# Altium schematic sheet SolderingStation_Processor.SchDoc
size A4
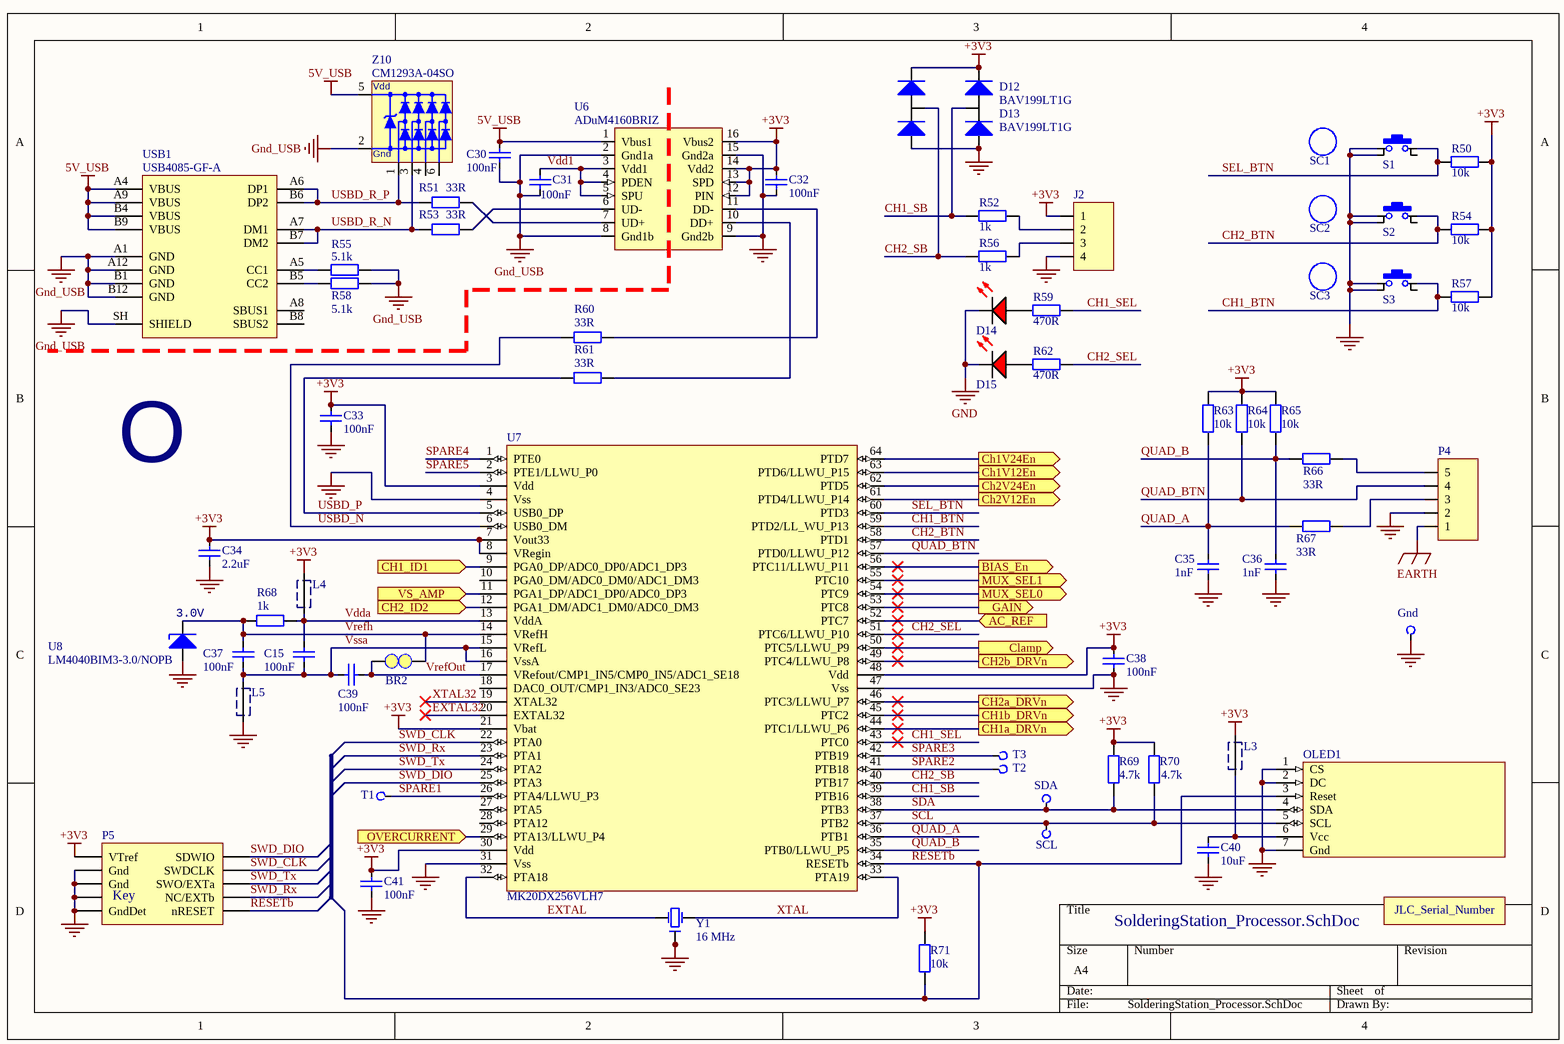
[diagram p0: SolderingStation_Processor.SchDoc]

## Parts
BR2  Solder Bridge (Open)  [SolderBridge(Open)]  (value not drawn)  (no BOM)
C15  100nF  [CCNP1608-0603_N]
C30  100nF  [CCNP1608-0603_N]
C31  100nF  [CCNP1608-0603_N]
C32  100nF  [CCNP1608-0603_N]
C33  100nF  [CCNP1608-0603_N]
C34  2.2uF  [CCNP1608-0603_N]
C35  1nF  [CCNP1608-0603_N]
C36  1nF  [CCNP1608-0603_N]
C37  100nF  [CCNP1608-0603_N]
C38  100nF  [CCNP1608-0603_N]
C39  100nF  [CCNP1608-0603_N]
C40  10uF  [CCNP2012-0805]
C41  100nF  [CCNP1608-0603_N]
D12  BAV199LT1G  [SOT23_M]
D13  BAV199LT1G  [SOT23_M]
D14  LED  [LED3MM-RED - 10mm Proud]  (value not drawn)
D15  LED  [LED3MM-RED - 10mm Proud]  (value not drawn)
Gnd  Gnd  [PCBPIN - 0.9mm]  (value not drawn)  (no BOM)
J2  JST XH Connector, 4-Pin  [jst-b4b-xh-ax]  (value not drawn)
JLC_Serial_Number1  JLC_Serial_Number  [JLC_Serial_Number]  (value not drawn)  (no BOM)
L3  Ferrite Bead 600R@100MHz  [FB2012-0805]  (value not drawn)
L4  Ferrite Bead 600R@100MHz  [FB1608-0603]  (value not drawn)
L5  Ferrite Bead 600R@100MHz  [FB1608-0603]  (value not drawn)
Logo1  OSHW Logo  [OSHW]  (value not drawn)  (no BOM)
OLED1  OLED_Display  [OLED_Display_128x64_2.4inch - no mounting holes]  (value not drawn)
P4  Header, 5-Pin  [HDR1X5S]  (value not drawn)
P5  SWD Connector 2x5-Pin  [SWD-2x5-Jig-Header]  (value not drawn)  (no BOM)
R50  10k  [CR1608-0603_N]
R51  33R  [CR1608-0603_N]
R52  1k  [CR1608-0603_N]
R53  33R  [CR1608-0603_N]
R54  10k  [CR1608-0603_N]
R55  5.1k  [CR1608-0603_N]
R56  1k  [CR1608-0603_N]
R57  10k  [CR1608-0603_N]
R58  5.1k  [CR1608-0603_N]
R59  470R  [CR1608-0603_N]
R60  33R  [CR1608-0603_N]
R61  33R  [CR1608-0603_N]
R62  470R  [CR1608-0603_N]
R63  10k  [CR1608-0603_N]
R64  10k  [CR1608-0603_N]
R65  10k  [CR1608-0603_N]
R66  33R  [CR1608-0603_N]
R67  33R  [CR1608-0603_N]
R68  1k  [CR1608-0603_N]
R69  4.7k  [CR1608-0603_N]
R70  4.7k  [CR1608-0603_N]
R71  10k  [CR1608-0603_N]
S1  SW_PB-B3F1052  [SW_MIN_PB-B3F1052]  (value not drawn)
S2  SW_PB-B3F1052  [SW_MIN_PB-B3F1052]  (value not drawn)
S3  SW_PB-B3F1052  [SW_MIN_PB-B3F1052]  (value not drawn)
SC1  B32-2010  [SW-CAP-B32-2010]  (value not drawn)
SC2  B32-2010  [SW-CAP-B32-2010]  (value not drawn)
SC3  B32-2010  [SW-CAP-B32-2010]  (value not drawn)
SCL  SCL  [PCBPIN - 0.9mm]  (value not drawn)  (no BOM)
SDA  SDA  [PCBPIN - 0.9mm]  (value not drawn)  (no BOM)
T1  PTA4  [PCBPIN - 0.9mm]  (value not drawn)  (no BOM)
T2  PTB18  [PCBPIN - 0.9mm]  (value not drawn)  (no BOM)
T3  PTB19  [PCBPIN - 0.9mm]  (value not drawn)  (no BOM)
U6  ADuM4160BRIZ  [SOIC127P1030-16M]
U7  MK20DX256VLH7  [TSQFP50P1200X1200-64M]
U8  LM4040BIM3-3.0/NOPB  [SOT23_M]
USB1  USB4085-GF-A  [USB4085-GF-A]
Y1  16 MHz  [Crystal_SMD_3.2x2.5]
Z10  CM1293A-04SO  [SOT457_M - 180]

## Ports
AC_REF (in), BIAS_En (out), CH1_ID1 (in), CH1a_DRVn (out), CH1b_DRVn (out), Ch1V12En (out), Ch1V24En (out), CH2_ID2 (in), CH2a_DRVn (out), CH2b_DRVn (out), Ch2V12En (out), Ch2V24En (out), Clamp (out), GAIN (out), MUX_SEL0 (out), MUX_SEL1 (out), OVERCURRENT (in), VS_AMP (in)

## Nets
5V_USB: C30.2 U6.1(Vbus1) USB1.A4(VBUS) USB1.A9(VBUS) USB1.B4(VBUS) USB1.B9(VBUS) Z10.5(Vp)
+3V3: C32.2 C33.2 C34.2 C38.2 C41.2 D12.2(A2) D13.2(A2) J2.1 L3.1 L4.2 P5.1(VTref) R50.2 R54.2 R57.2 R63.2 R64.2 R65.2 R69.2 R70.2 R71.2 U6.12(PIN) U6.13(SPD) U6.14(Vdd2) U6.16(Vbus2) U7.3(Vdd) U7.7(Vout33) U7.8(VRegin) U7.21(Vbat) U7.30(Vdd) U7.48(Vdd)
EARTH: P4.1
GND: C32.1 C33.1 C34.1 C35.1 C36.1 C38.1 C40.1 C41.1 D12.1(A1) D13.1(A1) D14.K D15.K Gnd.1(TP) J2.4 L5.1 OLED1.1(CS) OLED1.2(DC) OLED1.7(Gnd) P4.2 P5.0(Pins) P5.3(Gnd) P5.5(Gnd) P5.9(GndDet) S1.1 S1.1b S2.1 S2.1b S3.1 S3.1b U6.9(Gnd2b) U6.15(Gnd2a) U7.4(Vss) U7.31(Vss) U7.47(Vss) U8.2(A) Y1.2(Gnd) Y1.4(Gnd)
Gnd_USB: C30.1 C31.1 R55.2 R58.2 U6.2(Gnd1a) U6.8(Gnd1b) USB1.A1(GND) USB1.A12(GND) USB1.B1(GND) USB1.B12(GND) USB1.SH(SHIELD) Z10.2(Vn)
AC_REF: U7.52(PTC7) ; port AC_REF
BIAS_En: U7.56(PTC11/LLWU_P11) ; port BIAS_En
CH1_BTN: R57.1 S3.2 U7.59(PTD2/LL_WU_P13)
CH1_ID1: U7.9(PGA0_DP/ADC0_DP0/ADC1_DP3) ; port CH1_ID1
CH1_SB: D13.3(K) R52.1 U7.39(PTB16)
CH1_SEL: R59.1 U7.43(PTC0)
CH1a_DRVn: U7.44(PTC1/LLWU_P6) ; port CH1a_DRVn
CH1b_DRVn: U7.45(PTC2) ; port CH1b_DRVn
Ch1V12En: U7.63(PTD6/LLWU_P15) ; port Ch1V12En
Ch1V24En: U7.64(PTD7) ; port Ch1V24En
CH2_BTN: R54.1 S2.2 U7.58(PTD1)
CH2_ID2: U7.12(PGA1_DM/ADC1_DM0/ADC0_DM3) ; port CH2_ID2
CH2_SB: D12.3(K) R56.1 U7.40(PTB17)
CH2_SEL: R62.2 U7.51(PTC6/LLWU_P10)
CH2a_DRVn: U7.46(PTC3/LLWU_P7) ; port CH2a_DRVn
CH2b_DRVn: U7.49(PTC4/LLWU_P8) ; port CH2b_DRVn
Ch2V12En: U7.61(PTD4/LLWU_P14) ; port Ch2V12En
Ch2V24En: U7.62(PTD5) ; port Ch2V24En
Clamp: U7.50(PTC5/LLWU_P9) ; port Clamp
EXTAL: U7.32(PTA18) Y1.3(OSC2)
EXTAL32: U7.20(EXTAL32)
GAIN: U7.53(PTC8) ; port GAIN
MUX_SEL0: U7.54(PTC9) ; port MUX_SEL0
MUX_SEL1: U7.55(PTC10) ; port MUX_SEL1
OVERCURRENT: U7.29(PTA13/LLWU_P4) ; port OVERCURRENT
QUAD_A: C35.2 R63.1 R67.2 U7.36(PTB1)
QUAD_B: C36.2 R65.1 R66.2 U7.35(PTB0/LLWU_P5)
QUAD_BTN: P4.4 R64.1 U7.57(PTD0/LLWU_P12)
RESETb: OLED1.3(Reset) P5.10(nRESET) R71.1 U7.34(RESETb)
SCL: OLED1.5(SCL) R70.1 SCL.1(TP) U7.37(PTB2)
SDA: OLED1.4(SDA) R69.1 SDA.1(TP) U7.38(PTB3)
SEL_BTN: R50.1 S1.2 U7.60(PTD3)
SPARE1: T1.1(TP) U7.26(PTA4/LLWU_P3)
SPARE2: T2.1(TP) U7.41(PTB18)
SPARE3: T3.1(TP) U7.42(PTB19)
SPARE4: U7.1(PTE0)
SPARE5: U7.2(PTE1/LLWU_P0)
SWD_CLK: P5.4(SWDCLK) U7.22(PTA0)
SWD_DIO: P5.2(SDWIO) U7.25(PTA3)
SWD_Rx: P5.8(NC/EXTb) U7.23(PTA1)
SWD_Tx: P5.6(SWO/EXTa) U7.24(PTA2)
USBD_N: R60.2 U7.6(USB0_DM)
USBD_P: R61.2 U7.5(USB0_DP)
USBD_R_N: R53.2 USB1.A7(DM1) USB1.B7(DM2) Z10.3
USBD_R_P: R51.2 USB1.A6(DP1) USB1.B6(DP2) Z10.1
Vdd1: C31.2 U6.3(Vdd1) U6.4(PDEN) U6.5(SPU)
Vdda: C15.2 L4.1 R68.1 U7.13(VddA)
Vrefh: BR2.2 C37.2 R68.2 U7.14(VRefH) U8.1(K)
VrefOut: BR2.1 C39.2 U7.17(VRefout/CMP1_IN5/CMP0_IN5/ADC1_SE18)
VS_AMP: U7.11(PGA1_DP/ADC1_DP0/ADC0_DP3) ; port VS_AMP
Vssa: C15.1 C37.1 C39.1 L5.2 U7.15(VRefL) U7.16(VssA)
XTAL: U7.33(PTA19) Y1.1(OSC1)
XTAL32: U7.19(XTAL32)
NetC40_2: C40.2 L3.2 OLED1.6(Vcc)
NetD14_A: D14.A R59.2
NetD15_A: D15.A R62.1
NetJ2_2: J2.2 R52.2
NetJ2_3: J2.3 R56.2
NetP4_3: P4.3 R67.1
NetP4_5: P4.5 R66.1
NetR51_1: R51.1 U6.7(UD+)
NetR53_1: R53.1 U6.6(UD-)
NetR55_1: R55.1 USB1.A5(CC1)
NetR58_1: R58.1 USB1.B5(CC2)
NetR60_1: R60.1 U6.11(DD-)
NetR61_1: R61.1 U6.10(DD+)

Not connected (* = marked no-connect by the designer): S1 2b; S2 2b; S3 2b; U7 10(PGA0_DM/ADC0_DM0/ADC1_DM3) 18(DAC0_OUT/CMP1_IN3/ADC0_SE23) 27(PTA5) 28(PTA12); U8 3(NC); USB1 A8(SBUS1) B8(SBUS2); Z10 4 6

## Notes on the sheet
- (near U8) 3.0V
- (in symbol CM1293A-04SO) Vdd; Gnd
- (in symbol OSHW Logo) O
- (in symbol SWD2X5_JIG) Key

## Library data of the parts
BR2 = SolderBridge(Open): Solder bridge; Digikey: *; Farnell PN: *; LCSC: *
C15 C30-C33 C37-C39 C41 = Cap_CCNP_0603_100nF: Capacitor non-polar SMT 0603; Manufacturer: Generic Components; Class: Passive; Published: 08/06/2000; Publisher: Altium Hobart Technology Centre; SubClass: Capacitor; Farnell PN: *; Digikey: *; Value: 100nF; LCSC: C14663
C34 = Cap_CCNP_0603_2u2F: Capacitor non-polar SMT 0603; Manufacturer: Generic Components; Class: Passive; Published: 08/06/2000; Publisher: Altium Hobart Technology Centre; SubClass: Capacitor; Farnell PN: *; Digikey: *; Value: 2.2uF; LCSC: C23630
C35 C36 = Cap_CCNP_0603_1nF: Capacitor non-polar SMT 0603; Manufacturer: Generic Components; Class: Passive; Published: 08/06/2000; Publisher: Altium Hobart Technology Centre; SubClass: Capacitor; Farnell PN: *; Digikey: *; Value: 1nF; LCSC: C1588
C40 = Cap_CCNP_0805_10uF: Capacitor non-polar SMT 0805; Manufacturer: Generic Components; Class: Passive; Published: 08/06/2000; Publisher: Altium Hobart Technology Centre; SubClass: Capacitor; Farnell PN: *; Digikey: *; Value: 10uF; LCSC: C15850
D12 D13 = BAV199LT1G: Dual Series low-leakage switching diodes, 3-Pin SOT-23; Digikey: BAV199LT1GOSCT-ND; Farnell PN: 1431115; LCSC: C145516
D14 D15 = LED_3MM_RED: 3mm Red LED; Manufacturer: Generic Components; Class I: Optoelectronic; Published: 8-Jun-2000; Revision: July-2002: Re-released for DXP Platform.; Publisher: Altium Limited; Class II: LED; Digikey: *; Farnell PN: *; LCSC: *
Gnd SCL SDA T1-T3 = TP: Test Point; Digikey: *; Farnell PN: *; LCSC: *
J2 = JST-B4B-XH-A: LatestRevisionDate: 17-Jul-2002; LatestRevisionNote: Re-released for DXP Platform.; Publisher: Altium Limited; LCSC: *; Farnell PN: 1516278; Digikey: 455-2249-ND
L3 = Ferrite Bead 0805 600R: Ferrite Bead 600Ω @ 100MHz 1 500mA 300mΩ 0805; Farnell PN: *; Digikey: *; LCSC: C1017
L4 L5 = Ferrite Bead 0603 600R: Ferrite Bead 600Ω @ 100MHz 1 200mA 450mΩ 0603; Farnell PN: *; Digikey: *; LCSC: C1002
OLED1 = OLED_Display_128x64_2.4inch: OLED Display 128x64 pixels, 2.4inch; LCSC: *
P4 = Header 1x5: LatestRevisionDate: 17-Jul-2002; LatestRevisionNote: Re-released for DXP Platform.; Publisher: Altium Limited; LCSC: *
P5 = SWD2X5_JIG: LatestRevisionDate: 17-Jul-2002; LatestRevisionNote: Re-released for DXP Platform.; Publisher: Altium Limited; Farnell PN: 1865285; LCSC: *
R50 R54 R57 R63-R65 R71 = Res_CR0603_10k: Resistor SMT 0603; Manufacturer: Generic Components; Class: Passive; Published: 08/06/2000; Publisher: Altium Hobart Technology Centre; SubClass: Resistor; Farnell PN: *; Digikey: *; Value: 10k; LCSC: C25804
R51 R53 R60 R61 R66 R67 = Res_CR0603_33R: Resistor SMT 0603; Manufacturer: Generic Components; Class: Passive; Published: 08/06/2000; Publisher: Altium Hobart Technology Centre; SubClass: Resistor; Farnell PN: *; Digikey: *; Value: 33R; LCSC: C23140
R52 R56 R68 = Res_CR0603_1k: Resistor SMT 0603; Manufacturer: Generic Components; Class: Passive; Published: 08/06/2000; Publisher: Altium Hobart Technology Centre; SubClass: Resistor; Farnell PN: *; Digikey: *; Value: 1k; LCSC: C21190
R55 R58 = Res_CR0603_5k1: Resistor SMT 0603; Manufacturer: Generic Components; Class: Passive; Published: 08/06/2000; Publisher: Altium Hobart Technology Centre; SubClass: Resistor; Farnell PN: *; Digikey: *; Value: 5.1k; LCSC: C23186
R59 R62 = Res_CR0603_470R: Resistor SMT 0603; Manufacturer: Generic Components; Class: Passive; Published: 08/06/2000; Publisher: Altium Hobart Technology Centre; SubClass: Resistor; Farnell PN: *; Digikey: *; Value: 470R; LCSC: C23179
R69 R70 = Res_CR0603_4k7: Resistor SMT 0603; Manufacturer: Generic Components; Class: Passive; Published: 08/06/2000; Publisher: Altium Hobart Technology Centre; SubClass: Resistor; Farnell PN: *; Digikey: *; Value: 4.7k; LCSC: C23162
S1-S3 = SW_PB-B3F1052: Switch miniature push-button; Manufacturer: Generic Components; Published: 24-Mar-1999; Revision: July-2002: Re-released for DXP Platform.; Publisher: Altium Limited; Farnell PN: 196094202; LCSC: *
SC1-SC3 = Switch-Cap - B32-2010: Switch Cap; Farnell PN: 2352313
U6 = ADuM4160BRIZ: Full/Low Speed 5 kV USB Digital Isolator; Farnell PN: 2061081
U7 = MK20DX256VLH7: Arm Cortex M4 / Applies to MK20DX64VLH7, MK20DX128VLH7, MK20DX256VLH7; LCSC: *
U8 = LM4040BIM3-2.5/NOPB: IC 2.5V VREF SHUNT 0.2% SOT23-3; Digikey: LM4040BIM3X-2.5/NOPBCT-ND; Farnell PN: 3124419; LCSC: C131939
USB1 = USB4085-GF-A: USB-C, USB 2.0 Receptacle Connector 16 Position Through Hole, Right Angle; Angle: 90; Part Number: USB4085-GF-A; Digikey Part Number: 2073-USB4085-GF-ACT-ND; Digikey Link: https://www.digikey.ee/product-detail/en/gct/USB4085-GF-A/2073-USB4085-GF-ACT-ND/9859733; Farnell PN: 2924867; Digikey: 2073-USB4085-GF-ACT-ND; LCSC: *
Y1 = Crystal 16MHz: Crystal SMD 3.2 x 2.5 x 0.7 mm; Manufacturer: Generic Components; Class: Oscillator; SubClass: Crystal Oscillator; Published: 08/06/2000; Publisher: Altium Hobart Technology Centre; Digikey: *; Farnell PN: *; LCSC: C13738
Z10 = CM1293A-04SO: Ultra low capacitance quadruple rail-to-rail ESD protection; Farnell PN: 2533258; Digikey: CM1293A-04SOOSCT-ND; LCSC: C393377